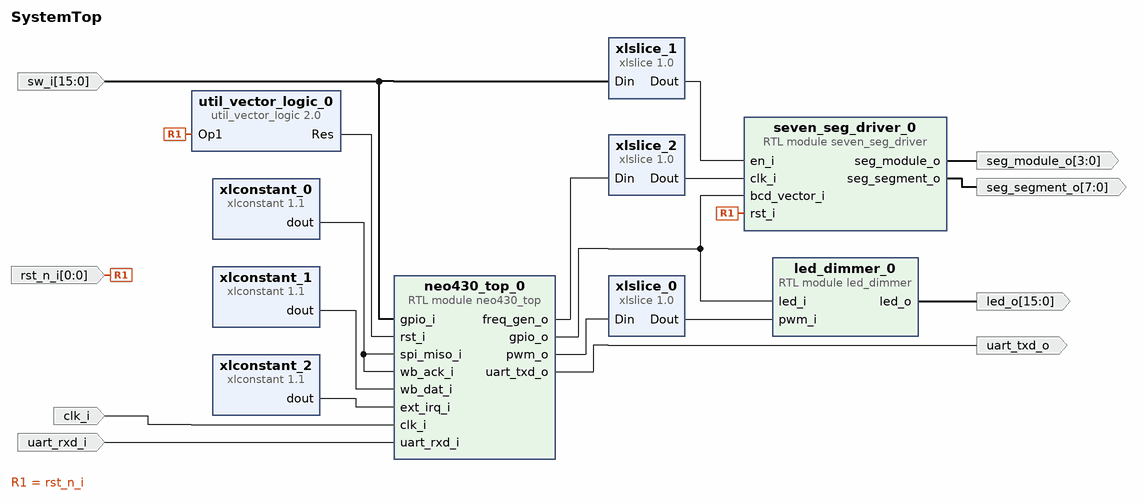
[diagram p0: block diagram of the top level]
# Vivado block design SystemTop, xc7a35tcpg236-1, Vivado 2021.2
create_bd_design SystemTop

create_bd_port -dir I -type clk clk_i
set_property -dict {CONFIG.FREQ_HZ 100000000} [get_bd_ports clk_i]
create_bd_port -dir I -from 0 -to 0 -type rst rst_n_i
set_property -dict {CONFIG.POLARITY ACTIVE_HIGH} [get_bd_ports rst_n_i]
create_bd_port -dir I -from 15 -to 0 -type data sw_i
create_bd_port -dir I -type data uart_rxd_i
create_bd_port -dir O -type data uart_txd_o
create_bd_port -dir O -from 15 -to 0 -type data led_o
create_bd_port -dir O -from 7 -to 0 -type data seg_segment_o
create_bd_port -dir O -from 3 -to 0 -type data seg_module_o

create_bd_cell -type module -reference neo430_top neo430_top_0
set_property -dict [list \
  CONFIG.CRC_USE false \
  CONFIG.EXIRQ_USE false \
  CONFIG.IMEM_SIZE 32768 \
  CONFIG.MULDIV_USE false \
  CONFIG.SPI_USE false \
  CONFIG.TWI_USE false \
  CONFIG.USER_CODE 0xCAFE \
  CONFIG.WB32_USE false \
  CONFIG.WDT_USE false \
] [get_bd_cells neo430_top_0]
create_bd_cell -type ip -vlnv xilinx.com:ip:util_vector_logic:2.0 util_vector_logic_0
set_property -dict {CONFIG.C_OPERATION not CONFIG.C_SIZE 1} [get_bd_cells util_vector_logic_0]
create_bd_cell -type ip -vlnv xilinx.com:ip:xlconstant:1.1 xlconstant_0
set_property -dict {CONFIG.CONST_VAL 0} [get_bd_cells xlconstant_0]
create_bd_cell -type ip -vlnv xilinx.com:ip:xlconstant:1.1 xlconstant_1
set_property -dict {CONFIG.CONST_VAL 0 CONFIG.CONST_WIDTH 32} [get_bd_cells xlconstant_1]
create_bd_cell -type ip -vlnv xilinx.com:ip:xlconstant:1.1 xlconstant_2
set_property -dict {CONFIG.CONST_VAL 0 CONFIG.CONST_WIDTH 8} [get_bd_cells xlconstant_2]
create_bd_cell -type module -reference led_dimmer led_dimmer_0
set_property -dict {CONFIG.length_g 16} [get_bd_cells led_dimmer_0]
create_bd_cell -type ip -vlnv xilinx.com:ip:xlslice:1.0 xlslice_0
set_property -dict {CONFIG.DIN_WIDTH 4} [get_bd_cells xlslice_0]
create_bd_cell -type ip -vlnv xilinx.com:ip:xlslice:1.0 xlslice_1
set_property -dict {CONFIG.DIN_WIDTH 16} [get_bd_cells xlslice_1]
create_bd_cell -type ip -vlnv xilinx.com:ip:xlslice:1.0 xlslice_2
set_property -dict {CONFIG.DIN_WIDTH 3} [get_bd_cells xlslice_2]
create_bd_cell -type module -reference seven_seg_driver seven_seg_driver_0

# ---- connections ----

connect_bd_net [get_bd_ports clk_i] [get_bd_pins neo430_top_0/clk_i]
connect_bd_net [get_bd_pins led_dimmer_0/led_o] [get_bd_ports led_o]
connect_bd_net [get_bd_pins neo430_top_0/freq_gen_o] [get_bd_pins xlslice_2/Din]
connect_bd_net [get_bd_pins neo430_top_0/gpio_o] [get_bd_pins led_dimmer_0/led_i] [get_bd_pins seven_seg_driver_0/bcd_vector_i]
connect_bd_net [get_bd_pins neo430_top_0/pwm_o] [get_bd_pins xlslice_0/Din]
connect_bd_net [get_bd_pins neo430_top_0/uart_txd_o] [get_bd_ports uart_txd_o]
connect_bd_net [get_bd_ports rst_n_i] [get_bd_pins util_vector_logic_0/Op1] [get_bd_pins seven_seg_driver_0/rst_i]
connect_bd_net [get_bd_pins seven_seg_driver_0/seg_module_o] [get_bd_ports seg_module_o]
connect_bd_net [get_bd_pins seven_seg_driver_0/seg_segment_o] [get_bd_ports seg_segment_o]
connect_bd_net [get_bd_ports sw_i] [get_bd_pins neo430_top_0/gpio_i] [get_bd_pins xlslice_1/Din]
connect_bd_net [get_bd_ports uart_rxd_i] [get_bd_pins neo430_top_0/uart_rxd_i]
connect_bd_net [get_bd_pins util_vector_logic_0/Res] [get_bd_pins neo430_top_0/rst_i]
connect_bd_net [get_bd_pins xlconstant_0/dout] [get_bd_pins neo430_top_0/spi_miso_i] [get_bd_pins neo430_top_0/wb_ack_i]
connect_bd_net [get_bd_pins xlconstant_1/dout] [get_bd_pins neo430_top_0/wb_dat_i]
connect_bd_net [get_bd_pins xlconstant_2/dout] [get_bd_pins neo430_top_0/ext_irq_i]
connect_bd_net [get_bd_pins xlslice_0/Dout] [get_bd_pins led_dimmer_0/pwm_i]
connect_bd_net [get_bd_pins xlslice_1/Dout] [get_bd_pins seven_seg_driver_0/en_i]
connect_bd_net [get_bd_pins xlslice_2/Dout] [get_bd_pins seven_seg_driver_0/clk_i]

validate_bd_design
save_bd_design
